# Altium project Router.PrjPcb
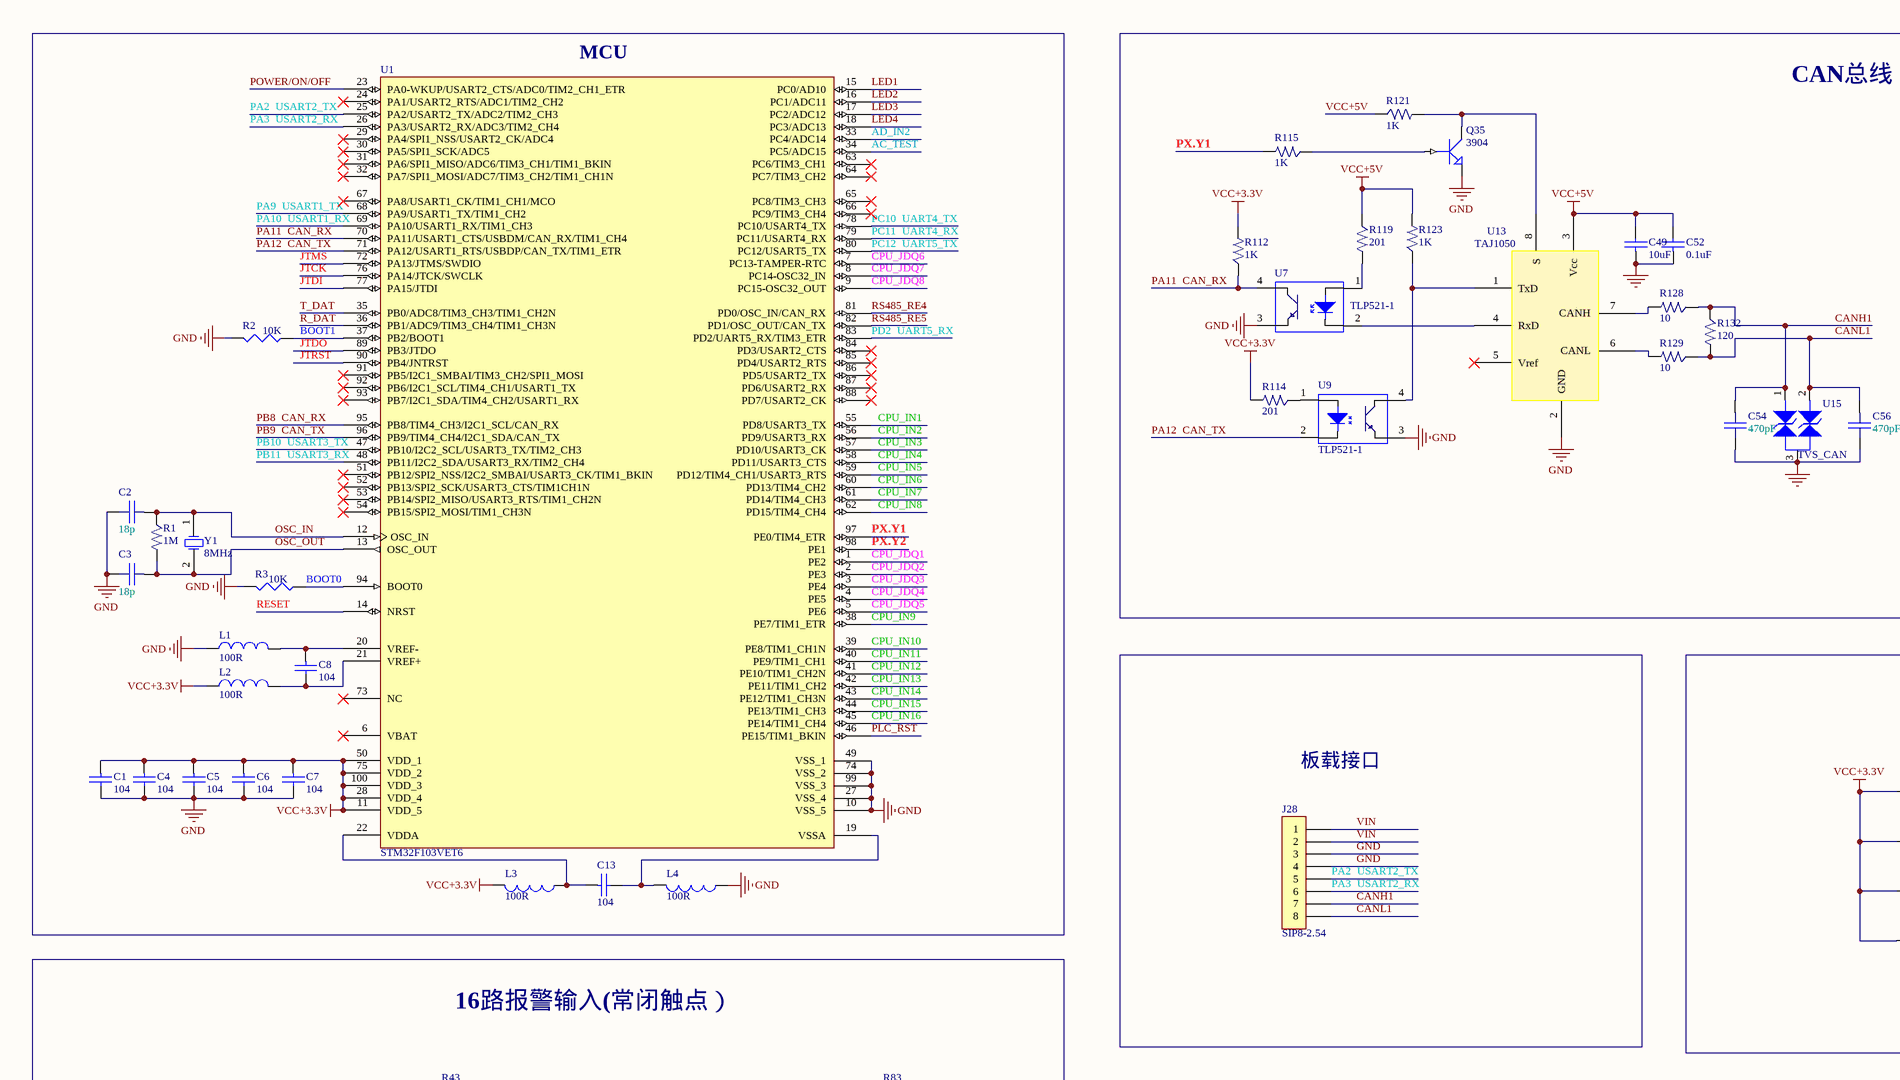
[diagram p0: Sheet1.SchDoc, top left]
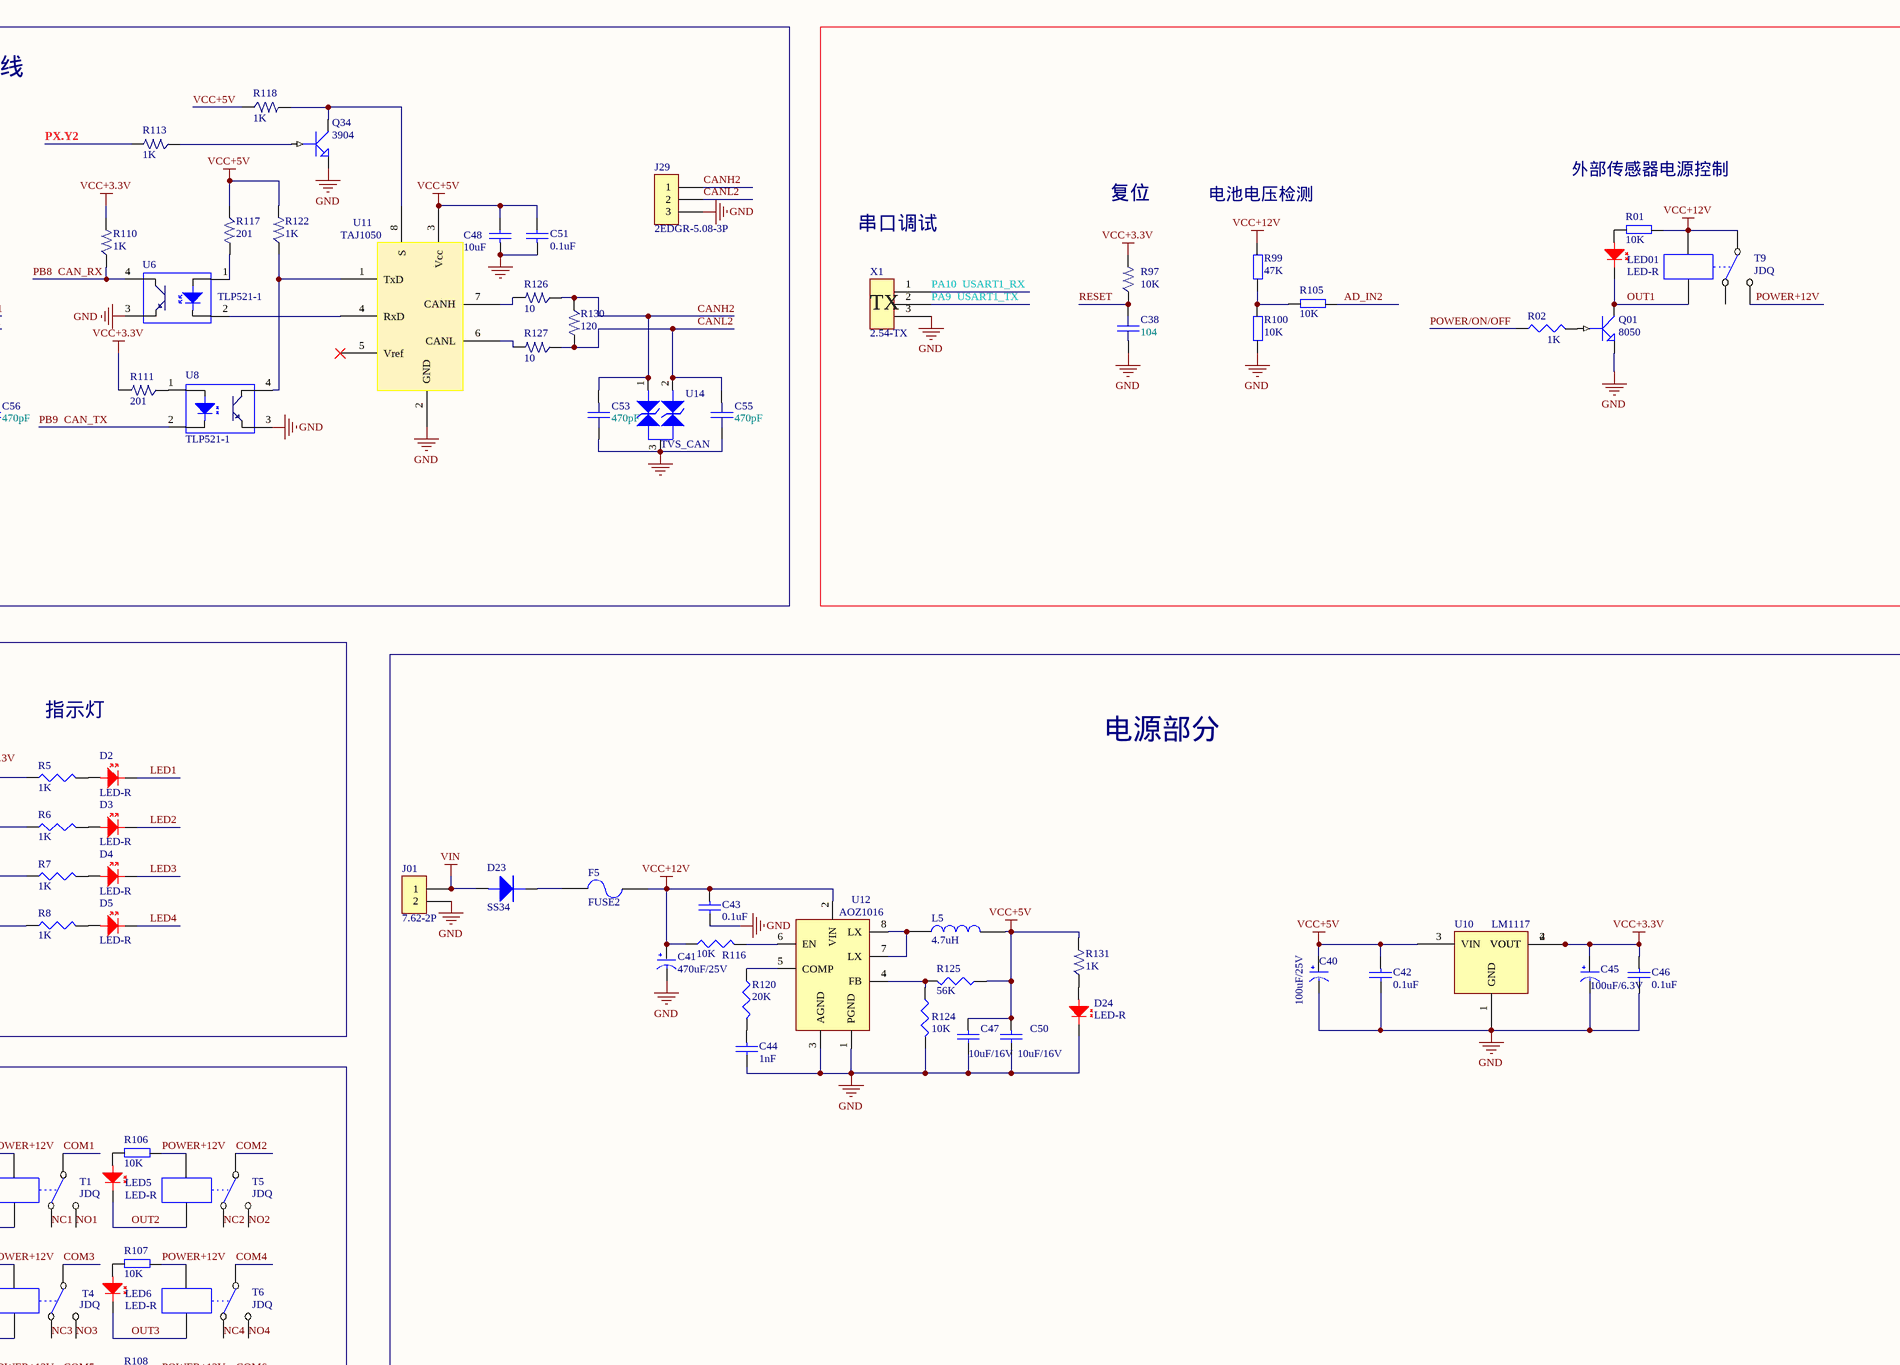
[diagram p1: Sheet1.SchDoc, top right]
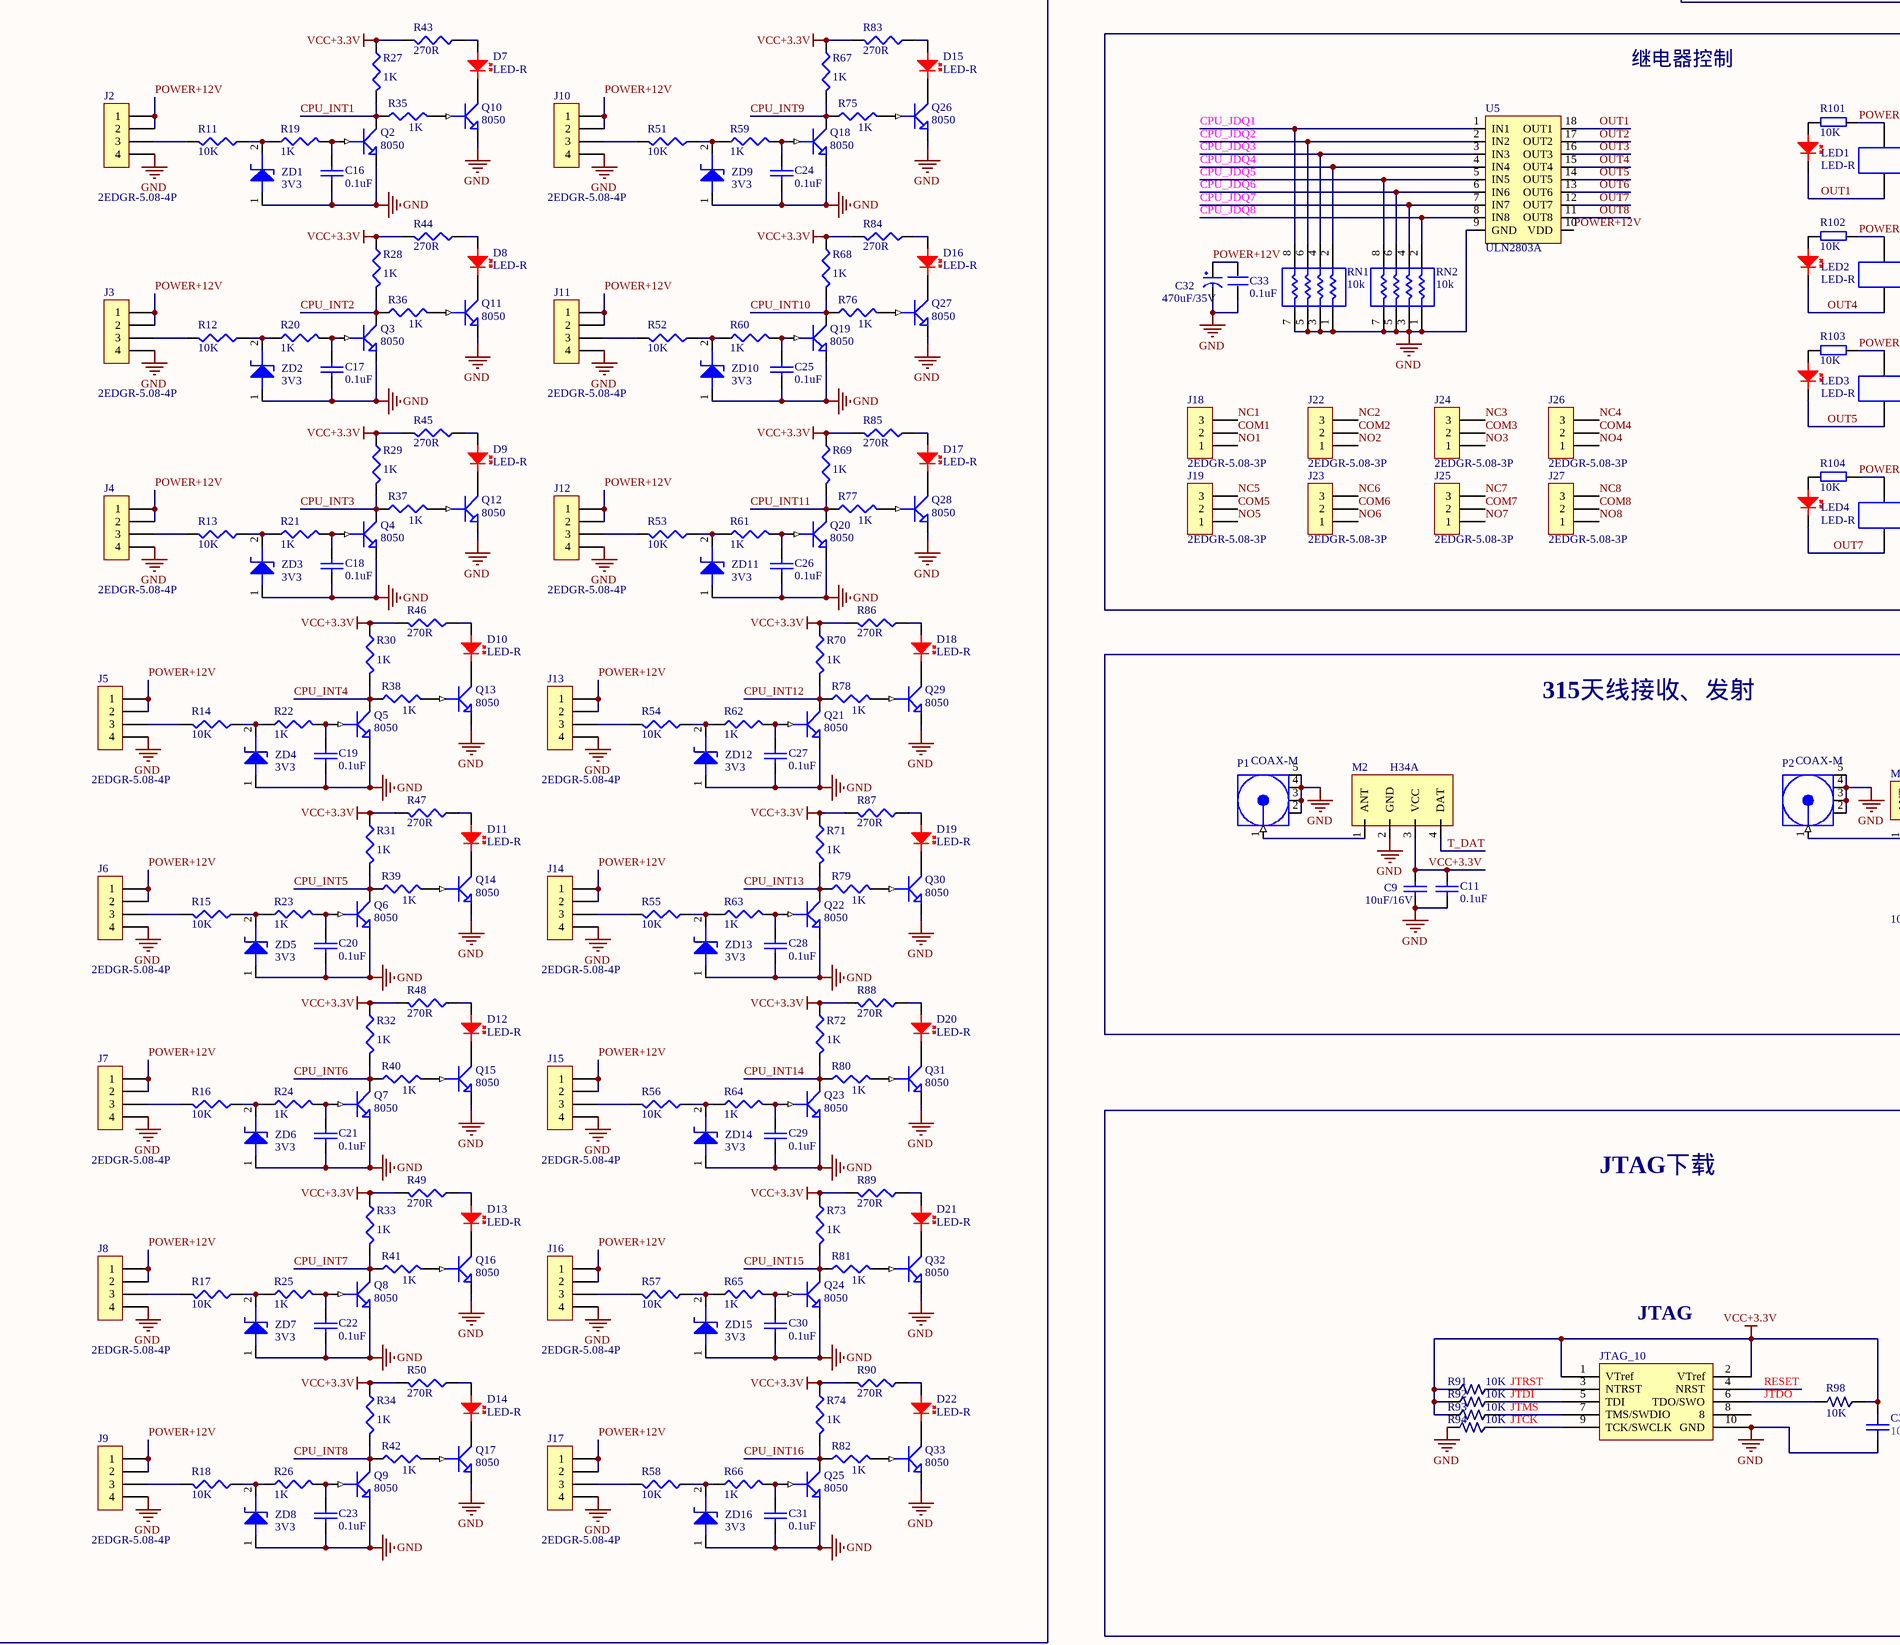
[diagram p2: Sheet1.SchDoc, bottom left]
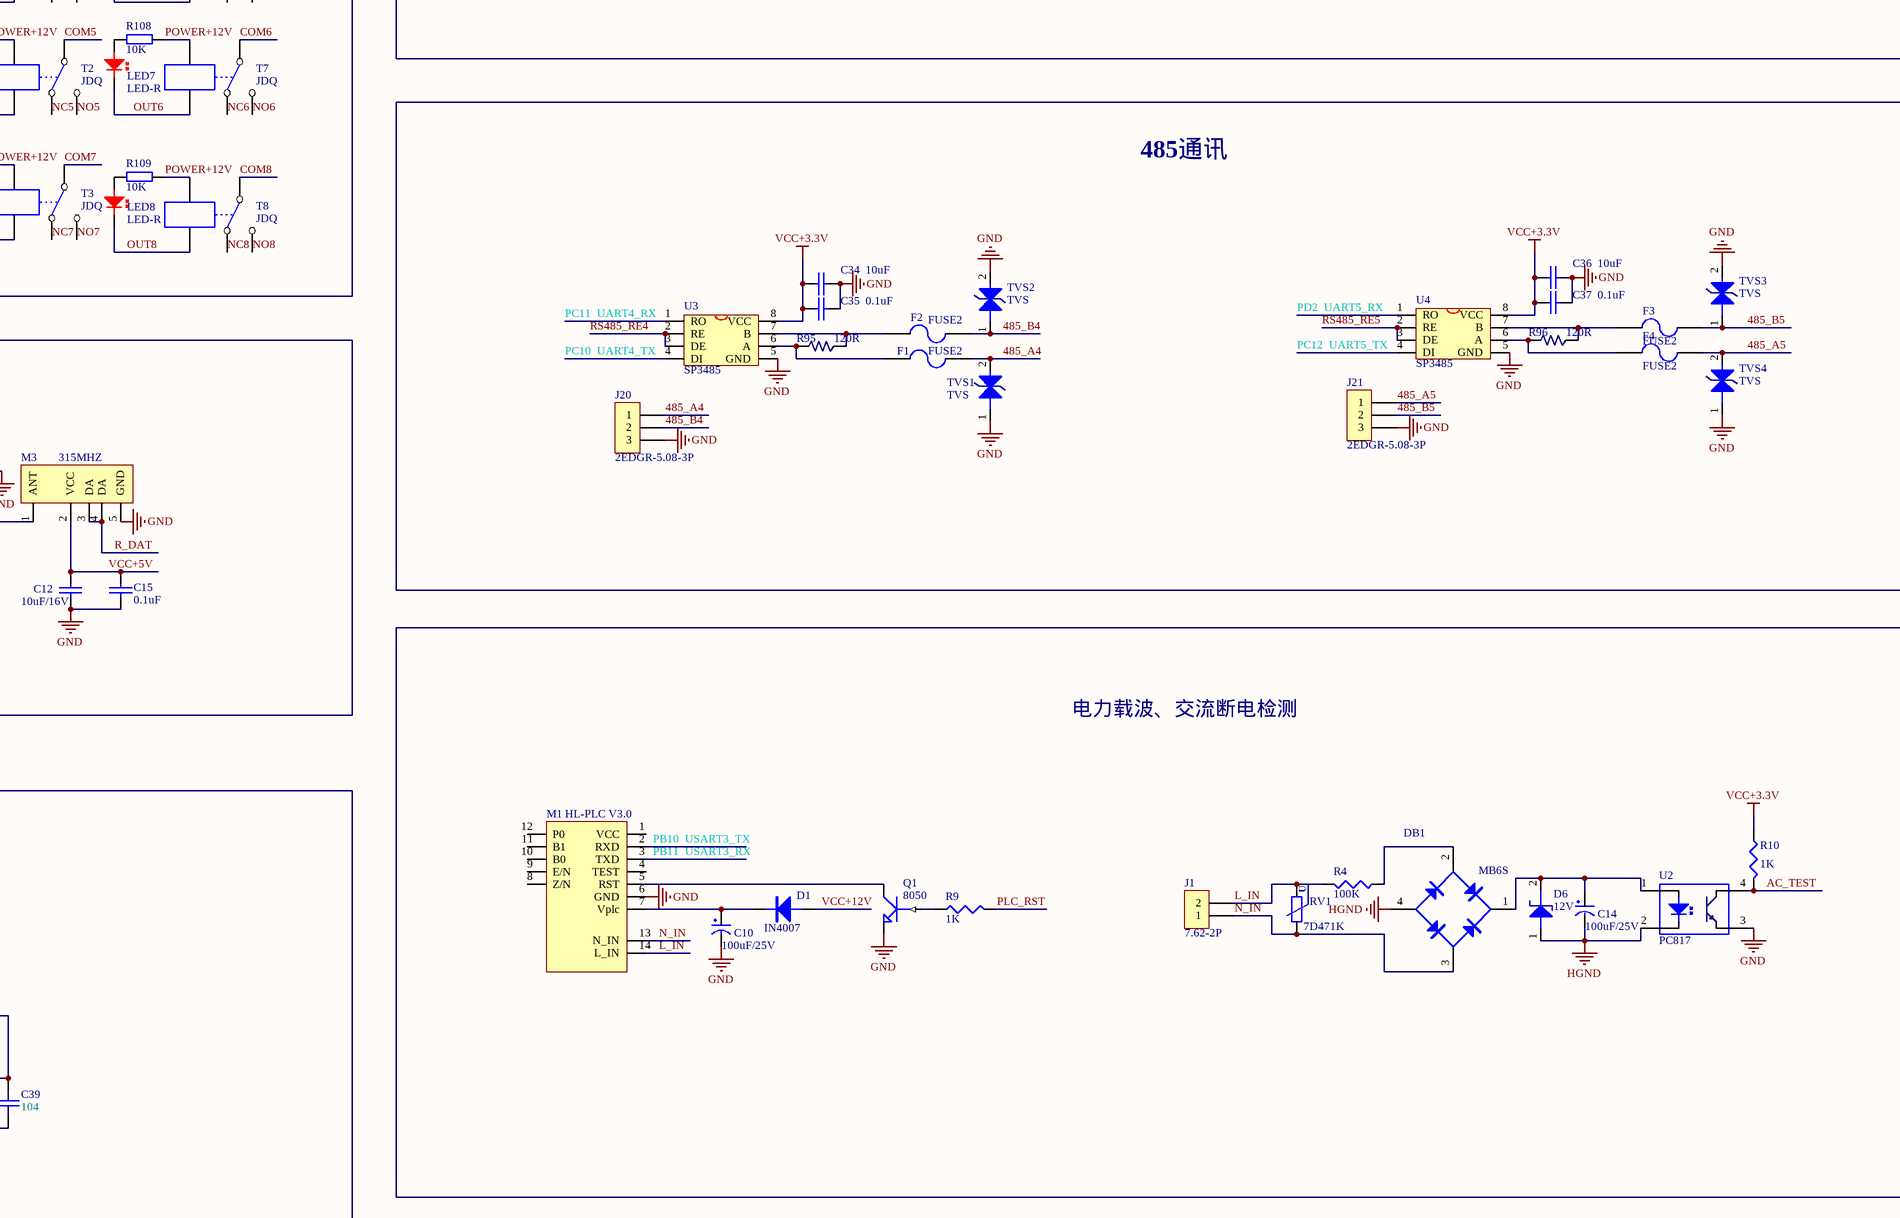
[diagram p3: Sheet1.SchDoc, bottom right]
1 sheet, 355 parts. Net scope: global (net labels, ports and power ports of the same name join across sheets).
Board file: PCB1.PcbDoc

## Sheet Sheet1.SchDoc
size A1

### Parts
C1  104  [0603]
C2  18p  [0603]
C3  18p  [0603]
C4  104  [0603]
C5  104  [0603]
C6  104  [0603]
C7  104  [0603]
C8  104  [0603]
C9  10uF/16V  [0805]
C10  100uF/25V  [RB2.54]
C11  0.1uF  [0603]
C12  10uF/16V  [0805]
C13  104  [0603]
C14  100uF/25V  [RB2.54]
C15  0.1uF  [0603]
C16  0.1uF  [0603]
C17  0.1uF  [0603]
C18  0.1uF  [0603]
C19  0.1uF  [0603]
C20  0.1uF  [0603]
C21  0.1uF  [0603]
C22  0.1uF  [0603]
C23  0.1uF  [0603]
C24  0.1uF  [0603]
C25  0.1uF  [0603]
C26  0.1uF  [0603]
C27  0.1uF  [0603]
C28  0.1uF  [0603]
C29  0.1uF  [0603]
C30  0.1uF  [0603]
C31  0.1uF  [0603]
C32  470uF/35V  [RB5.0-10]
C33  0.1uF  [0603]
C34  10uF  [0805]
C35  0.1uF  [0603]
C36  10uF  [0805]
C37  0.1uF  [0603]
C38  104  [0805]
C39  104  [0805]
C40  100uF/25V  [RB2.54]
C41  470uF/25V  [RB3.5]
C42  0.1uF  [0603]
C43  0.1uF  [0603]
C44  1nF  [0603]
C45  100uF/6.3V  [RB2.54]
C46  0.1uF  [0603]
C47  10uF/16V  [0805]
C48  10uF  [0805]
C49  10uF  [0805]
C50  10uF/16V  [0805]
C51  0.1uF  [0603]
C52  0.1uF  [0603]
C53  470pF  [0603]
C54  470pF  [0603]
C55  470pF  [0603]
C56  470pF  [0603]
D1  IN4007  [SMB]
D2  LED-R  [LED-0805]
D3  LED-R  [LED-0805]
D4  LED-R  [LED-0805]
D5  LED-R  [LED-0805]
D6  12V  [SOD-123A]
D7  LED-R  [LED-0805]
D8  LED-R  [LED-0805]
D9  LED-R  [LED-0805]
D10  LED-R  [LED-0805]
D11  LED-R  [LED-0805]
D12  LED-R  [LED-0805]
D13  LED-R  [LED-0805]
D14  LED-R  [LED-0805]
D15  LED-R  [LED-0805]
D16  LED-R  [LED-0805]
D17  LED-R  [LED-0805]
D18  LED-R  [LED-0805]
D19  LED-R  [LED-0805]
D20  LED-R  [LED-0805]
D21  LED-R  [LED-0805]
D22  LED-R  [LED-0805]
D23  SS34  [SMB]
D24  LED-R  [LED-0805]
DB1  MB6S  [SOIC-4]
F1  FUSE2  [0805]
F2  FUSE2  [0805]
F3  FUSE2  [0805]
F4  FUSE2  [0805]
F5  FUSE2  [FUSE RL60-110]
J1  7.62-2P  [7.62-2]
J01  7.62-2P  [5.08-2P]
J2  2EDGR-5.08-4P  [3.81-4P]
J3  2EDGR-5.08-4P  [3.81-4P]
J4  2EDGR-5.08-4P  [3.81-4P]
J5  2EDGR-5.08-4P  [3.81-4P]
J6  2EDGR-5.08-4P  [3.81-4P]
J7  2EDGR-5.08-4P  [3.81-4P]
J8  2EDGR-5.08-4P  [3.81-4P]
J9  2EDGR-5.08-4P  [3.81-4P]
J10  2EDGR-5.08-4P  [3.81-4P]
J11  2EDGR-5.08-4P  [3.81-4P]
J12  2EDGR-5.08-4P  [3.81-4P]
J13  2EDGR-5.08-4P  [3.81-4P]
J14  2EDGR-5.08-4P  [3.81-4P]
J15  2EDGR-5.08-4P  [3.81-4P]
J16  2EDGR-5.08-4P  [3.81-4P]
J17  2EDGR-5.08-4P  [3.81-4P]
J18  2EDGR-5.08-3P  [5.08-3P]
J19  2EDGR-5.08-3P  [5.08-3P]
J20  2EDGR-5.08-3P  [5.08-3P]
J21  2EDGR-5.08-3P  [5.08-3P]
J22  2EDGR-5.08-3P  [5.08-3P]
J23  2EDGR-5.08-3P  [5.08-3P]
J24  2EDGR-5.08-3P  [5.08-3P]
J25  2EDGR-5.08-3P  [5.08-3P]
J26  2EDGR-5.08-3P  [5.08-3P]
J27  2EDGR-5.08-3P  [5.08-3P]
J28  SIP8-2.54  [2.54-8]
J29  2EDGR-5.08-3P  [5.08-3P]
JTAG_1  JTAG_10  [JTAG_10]
L1  100R  [0805]
L2  100R  [0805]
L3  100R  [0805]
L4  100R  [0805]
L5  4.7uH  [INDUCTOR 7*7]
LED1  LED-R  [LED-0805]
LED01  LED-R  [LED-0805]
LED2  LED-R  [LED-0805]
LED3  LED-R  [LED-0805]
LED4  LED-R  [LED-0805]
LED5  LED-R  [LED-0805]
LED6  LED-R  [LED-0805]
LED7  LED-R  [LED-0805]
LED8  LED-R  [LED-0805]
M1  HL-PLC V3.0  [HL-PLC V3.0]
M2  H34A  [H34A]
M3  315MHZ  [315MHZ]
P1  COAX-M  [ST-TH1]
P2  COAX-M  [ST-TH1]
Q1  8050  [SOT-23]
Q01  8050  [SOT-23]
Q2  8050  [SOT-23]
Q3  8050  [SOT-23]
Q4  8050  [SOT-23]
Q5  8050  [SOT-23]
Q6  8050  [SOT-23]
Q7  8050  [SOT-23]
Q8  8050  [SOT-23]
Q9  8050  [SOT-23]
Q10  8050  [SOT-23]
Q11  8050  [SOT-23]
Q12  8050  [SOT-23]
Q13  8050  [SOT-23]
Q14  8050  [SOT-23]
Q15  8050  [SOT-23]
Q16  8050  [SOT-23]
Q17  8050  [SOT-23]
Q18  8050  [SOT-23]
Q19  8050  [SOT-23]
Q20  8050  [SOT-23]
Q21  8050  [SOT-23]
Q22  8050  [SOT-23]
Q23  8050  [SOT-23]
Q24  8050  [SOT-23]
Q25  8050  [SOT-23]
Q26  8050  [SOT-23]
Q27  8050  [SOT-23]
Q28  8050  [SOT-23]
Q29  8050  [SOT-23]
Q30  8050  [SOT-23]
Q31  8050  [SOT-23]
Q32  8050  [SOT-23]
Q33  8050  [SOT-23]
Q34  3904  [SOT-23]
Q35  3904  [SOT-23]
R1  1M  [0805]
R01  10K  [0603]
R2  10K  [0603]
R02  1K  [0603]
R3  10K  [0603]
R4  100K  [AXIAL0.6]
R5  1K  [0603]
R6  1K  [0603]
R7  1K  [0603]
R8  1K  [0603]
R9  1K  [0603]
R10  1K  [0603]
R11  10K  [0603]
R12  10K  [0603]
R13  10K  [0603]
R14  10K  [0603]
R15  10K  [0603]
R16  10K  [0603]
R17  10K  [0603]
R18  10K  [0603]
R19  1K  [0603]
R20  1K  [0603]
R21  1K  [0603]
R22  1K  [0603]
R23  1K  [0603]
R24  1K  [0603]
R25  1K  [0603]
R26  1K  [0603]
R27  1K  [0603]
R28  1K  [0603]
R29  1K  [0603]
R30  1K  [0603]
R31  1K  [0603]
R32  1K  [0603]
R33  1K  [0603]
R34  1K  [0603]
R35  1K  [0603]
R36  1K  [0603]
R37  1K  [0603]
R38  1K  [0603]
R39  1K  [0603]
R40  1K  [0603]
R41  1K  [0603]
R42  1K  [0603]
R43  270R  [0603]
R44  270R  [0603]
R45  270R  [0603]
R46  270R  [0603]
R47  270R  [0603]
R48  270R  [0603]
R49  270R  [0603]
R50  270R  [0603]
R51  10K  [0603]
R52  10K  [0603]
R53  10K  [0603]
R54  10K  [0603]
R55  10K  [0603]
R56  10K  [0603]
R57  10K  [0603]
R58  10K  [0603]
R59  1K  [0603]
R60  1K  [0603]
R61  1K  [0603]
R62  1K  [0603]
R63  1K  [0603]
R64  1K  [0603]
R65  1K  [0603]
R66  1K  [0603]
R67  1K  [0603]
R68  1K  [0603]
R69  1K  [0603]
R70  1K  [0603]
R71  1K  [0603]
R72  1K  [0603]
R73  1K  [0603]
R74  1K  [0603]
R75  1K  [0603]
R76  1K  [0603]
R77  1K  [0603]
R78  1K  [0603]
R79  1K  [0603]
R80  1K  [0603]
R81  1K  [0603]
R82  1K  [0603]
R83  270R  [0603]
R84  270R  [0603]
R85  270R  [0603]
R86  270R  [0603]
R87  270R  [0603]
R88  270R  [0603]
R89  270R  [0603]
R90  270R  [0603]
R91  10K  [0805]
R92  10K  [0805]
R93  10K  [0805]
R94  10K  [0805]
R95  120R  [0603]
R96  120R  [0603]
R97  10K  [0805]
R98  10K  [0805]
R99  47K  [0805]
R100  10K  [0805]
R101  10K  [0603]
R102  10K  [0603]
R103  10K  [0603]
R104  10K  [0603]
R105  10K  [0805]
R106  10K  [0603]
R107  10K  [0603]
R108  10K  [0603]
R109  10K  [0603]
R110  1K  [0603]
R111  201  [0603]
R112  1K  [0603]
R113  1K  [0603]
R114  201  [0603]
R115  1K  [0603]
R116  10K  [0603]
R117  201  [0603]
R118  1K  [0603]
R119  201  [0603]
R120  20K  [0603]
R121  1K  [0603]
R122  1K  [0603]
R123  1K  [0603]
R124  10K  [0603]
R125  56K  [0603]
R126  10  [0603]
R127  10  [0603]
R128  10  [0603]
R129  10  [0603]
R130  120  [0603]
R131  1K  [0603]
R132  120  [0603]
RN1  10k  [0603-4]
RN2  10k  [0603-4]
RV1  7D471K  [7D471]
T1  JDQ  [JDQ]
T2  JDQ  [JDQ]
T3  JDQ  [JDQ]
T4  JDQ  [JDQ]
T5  JDQ  [JDQ]
T6  JDQ  [JDQ]
T7  JDQ  [JDQ]
T8  JDQ  [JDQ]
T9  JDQ  [JDQ]
TVS1  TVS  [SMB]
TVS2  TVS  [SMB]
TVS3  TVS  [SMB]
TVS4  TVS  [SMB]
U1  STM32F103VET6  [LQFP100_L]
U2  PC817  [DIP4]
U3  SP3485  [SOP-8]
U4  SP3485  [SOP-8]
U5  ULN2803A  [SOIC-18]
U6  TLP521-1  [DIP4]
U7  TLP521-1  [DIP4]
U8  TLP521-1  [DIP4]
U9  TLP521-1  [DIP4]
U10  LM1117  [SOT-223]
U11  TAJ1050  [SO-8]
U12  AOZ1016  [SO-8]
U13  TAJ1050  [SO-8]
U14  TVS_CAN  [SOT-23]
U15  TVS_CAN  [SOT-23]
X1  2.54-TX  [2.54-TX]
Y1  8MHz  [XTAL_US]
ZD1  3V3  [SOD-123]
ZD2  3V3  [SOD-123]
ZD3  3V3  [SOD-123]
ZD4  3V3  [SOD-123]
ZD5  3V3  [SOD-123]
ZD6  3V3  [SOD-123]
ZD7  3V3  [SOD-123]
ZD8  3V3  [SOD-123]
ZD9  3V3  [SOD-123]
ZD10  3V3  [SOD-123]
ZD11  3V3  [SOD-123]
ZD12  3V3  [SOD-123]
ZD13  3V3  [SOD-123]
ZD14  3V3  [SOD-123]
ZD15  3V3  [SOD-123]
ZD16  3V3  [SOD-123]

### Blocks framed on the sheet
MCU: C1-C8 C13 L1-L4 R1-R3 U1 Y1
CAN总线: C48 C49 C51-C56 J29 Q34 Q35 R110-R115 R117-R119 R121-R123 R126-R130 R132 U6-U9 U11 U13-U15
板载接口: J28
指示灯: D2-D5 R5-R8
电源部分: C40-C47 C50 D23 D24 F5 J01 L5 R116 R120 R124 R125 R131 U10 U12
16路报警输入(常闭触点）: C16-C31 D7-D22 J2-J17 Q2-Q33 R11-R90 ZD1-ZD16
继电器控制: C32 C33 J18 J19 J22-J27 LED1-LED8 R101-R104 R106-R109 RN1 RN2 T1-T8 U5
485通讯: C34-C37 F1-F4 J20 J21 R95 R96 TVS1-TVS4 U3 U4
315天线接收、发射: C9 C11 C12 C15 M2 M3 P1 P2
电力载波、交流断电检测: C10 C14 D1 D6 DB1 J1 M1 Q1 R4 R9 R10 RV1 U2
JTAG下载: C39 JTAG_1 R91-R94 R98

### Nets
GND: C1.2 C2.2 C3.2 C4.2 C5.2 C6.2 C7.2 C9.1 C10.2(GND) C11.2 C12.2 C15.2 C16.2 C17.2 C18.2 C19.2 C20.2 C21.2 C22.2 C23.2 C24.2 C25.2 C26.2 C27.2 C28.2 C29.2 C30.2 C31.2 C32.2(GND) C33.1 C34.2 C35.2 C36.2 C37.2 C38.1 C39.2 C40.2(GND) C41.2(GND) C42.2 C43.2 C44.2 C45.2(GND) C46.2 C47.2 C48.1 C49.1 C50.2 C51.1 C52.1 C53.2 C54.2 C55.2 C56.2 D24.2 J01.2 J2.4 J3.4 J4.4 J5.4 J6.4 J7.4 J8.4 J9.4 J10.4 J11.4 J12.4 J13.4 J14.4 J15.4 J16.4 J17.4 J20.3 J21.3 J28.3 J28.4 J29.3 JTAG_1.10(GND) L1.1 L4.1 M1.6(GND) M2.2(GND) M3.5(GND) P1.2(GND) P1.3(GND) P1.4(GND) P1.5(GND) P2.2(GND) P2.3(GND) P2.4(GND) P2.5(GND) Q1.2(E) Q01.2(E) Q2.2(E) Q3.2(E) Q4.2(E) Q5.2(E) Q6.2(E) Q7.2(E) Q8.2(E) Q9.2(E) Q10.2(E) Q11.2(E) Q12.2(E) Q13.2(E) Q14.2(E) Q15.2(E) Q16.2(E) Q17.2(E) Q18.2(E) Q19.2(E) Q20.2(E) Q21.2(E) Q22.2(E) Q23.2(E) Q24.2(E) Q25.2(E) Q26.2(E) Q27.2(E) Q28.2(E) Q29.2(E) Q30.2(E) Q31.2(E) Q32.2(E) Q33.2(E) Q34.2(E) Q35.2(E) R2.2 R3.2 R94.2 R100.1 R124.2 RN1.1 RN1.3 RN1.5 RN1.7 RN2.1 RN2.3 RN2.5 RN2.7 TVS1.1(A) TVS2.2(K) TVS3.2(K) TVS4.1(A) U1.10(VSS_5) U1.27(VSS_4) U1.49(VSS_1) U1.74(VSS_2) U1.99(VSS_3) U2.3 U3.5(GND) U4.5(GND) U5.9(GND) U6.3 U7.3 U8.3 U9.3 U10.1(GND) U11.2(GND) U12.1(PGND) U12.3(AGND) U13.2(GND) U14.3 U15.3 X1.3 ZD1.1(A) ZD2.1(A) ZD3.1(A) ZD4.1(A) ZD5.1(A) ZD6.1(A) ZD7.1(A) ZD8.1(A) ZD9.1(A) ZD10.1(A) ZD11.1(A) ZD12.1(A) ZD13.1(A) ZD14.1(A) ZD15.1(A) ZD16.1(A)
HGND: C14.2(GND) D6.1(A) DB1.4(V-) U2.2
VCC+3.3V: C1.1 C4.1 C5.1 C6.1 C7.1 C9.2 C11.1 C34.1 C35.1 C36.1 C37.1 C39.1 C45.1(VCC) C46.1 JTAG_1.1(VTref) JTAG_1.2(VTref) L2.1 L3.2 M2.3(VCC) R5.1 R6.1 R7.1 R8.1 R10.1 R27.1 R28.1 R29.1 R30.1 R31.1 R32.1 R33.1 R34.1 R43.2 R44.2 R45.2 R46.2 R47.2 R48.2 R49.2 R50.2 R67.1 R68.1 R69.1 R70.1 R71.1 R72.1 R73.1 R74.1 R83.2 R84.2 R85.2 R86.2 R87.2 R88.2 R89.2 R90.2 R91.1 R92.1 R93.1 R97.2 R98.1 R110.2 R111.2 R112.2 R114.2 U1.11(VDD_5) U1.28(VDD_4) U1.50(VDD_1) U1.75(VDD_2) U1.100(VDD_3) U3.8(VCC) U4.8(VCC) U10.2(VOUT) U10.4(VOUT)
VCC+5V: C12.1 C15.1 C40.1(VCC) C42.1 C47.1 C48.2 C49.2 C50.1 C51.2 C52.2 L5.2 M3.2(VCC) R117.1 R118.1 R119.1 R121.1 R122.2 R123.2 R125.1 R131.2 U10.3(VIN) U11.3(Vcc) U13.3(Vcc)
VCC+12V: C41.1(VCC) C43.1 D1.1(A) F5.2 R01.1 R99.2 R116.1 T9.1 T9.4 U12.2(VIN)
VIN: D23.1(A) J01.1 J28.1 J28.2
485_A4: F1.2 J20.1 TVS1.2(K)
485_A5: F4.2 J21.1 TVS4.2(K)
485_B4: F2.2 J20.2 TVS2.1(A)
485_B5: F3.2 J21.2 TVS3.1(A)
AC_TEST: R10.2 U1.34(PC5/ADC15) U2.4
AD_IN2: R105.1 U1.33(PC4/ADC14)
BOOT0: R3.1 U1.94(BOOT0)
BOOT1: R2.1 U1.37(PB2/BOOT1)
CANH1: C54.1 J28.7 R128.1 R132.1 U15.1
CANH2: C53.1 J29.1 R126.1 R130.1 U14.1
CANL1: C56.1 J28.8 R129.1 R132.2 U15.2(K)
CANL2: C55.1 J29.2 R127.1 R130.2 U14.2(K)
COM1: J18.2 T1.1
COM2: J22.2 T5.1
COM3: J24.2 T4.1
COM4: J26.2 T6.1
COM5: J19.2 T2.1
COM6: J23.2 T7.1
COM7: J25.2 T3.1
COM8: J27.2 T8.1
CPU_IN1: U1.55(PD8/USART3_TX)
CPU_IN2: U1.56(PD9/USART3_RX)
CPU_IN3: U1.57(PD10/USART3_CK)
CPU_IN4: U1.58(PD11/USART3_CTS)
CPU_IN5: U1.59(PD12/TIM4_CH1/USART3_RTS)
CPU_IN6: U1.60(PD13/TIM4_CH2)
CPU_IN7: U1.61(PD14/TIM4_CH3)
CPU_IN8: U1.62(PD15/TIM4_CH4)
CPU_IN9: U1.38(PE7/TIM1_ETR)
CPU_IN10: U1.39(PE8/TIM1_CH1N)
CPU_IN11: U1.40(PE9/TIM1_CH1)
CPU_IN12: U1.41(PE10/TIM1_CH2N)
CPU_IN13: U1.42(PE11/TIM1_CH2)
CPU_IN14: U1.43(PE12/TIM1_CH3N)
CPU_IN15: U1.44(PE13/TIM1_CH3)
CPU_IN16: U1.45(PE14/TIM1_CH4)
CPU_INT1: Q2.3(C) R27.2 R35.1
CPU_INT2: Q3.3(C) R28.2 R36.1
CPU_INT3: Q4.3(C) R29.2 R37.1
CPU_INT4: Q5.3(C) R30.2 R38.1
CPU_INT5: Q6.3(C) R31.2 R39.1
CPU_INT6: Q7.3(C) R32.2 R40.1
CPU_INT7: Q8.3(C) R33.2 R41.1
CPU_INT8: Q9.3(C) R34.2 R42.1
CPU_INT9: Q18.3(C) R67.2 R75.1
CPU_INT10: Q19.3(C) R68.2 R76.1
CPU_INT11: Q20.3(C) R69.2 R77.1
CPU_INT12: Q21.3(C) R70.2 R78.1
CPU_INT13: Q22.3(C) R71.2 R79.1
CPU_INT14: Q23.3(C) R72.2 R80.1
CPU_INT15: Q24.3(C) R73.2 R81.1
CPU_INT16: Q25.3(C) R74.2 R82.1
CPU_JDQ1: RN1.8 U1.1(PE2) U5.1(IN1)
CPU_JDQ2: RN1.6 U1.2(PE3) U5.2(IN2)
CPU_JDQ3: RN1.4 U1.3(PE4) U5.3(IN3)
CPU_JDQ4: RN1.2 U1.4(PE5) U5.4(IN4)
CPU_JDQ5: RN2.8 U1.5(PE6) U5.5(IN5)
CPU_JDQ6: RN2.6 U1.7(PC13-TAMPER-RTC) U5.6(IN6)
CPU_JDQ7: RN2.4 U1.8(PC14-OSC32_IN) U5.7(IN7)
CPU_JDQ8: RN2.2 U1.9(PC15-OSC32_OUT) U5.8(IN8)
JTCK: JTAG_1.9(TCK/SWCLK) R94.1 U1.76(PA14/JTCK/SWCLK)
JTDI: JTAG_1.5(TDI) R92.2 U1.77(PA15/JTDI)
JTDO: JTAG_1.6(TDO/SWO) R98.2 U1.89(PB3/JTDO)
JTMS: JTAG_1.7(TMS/SWDIO) R93.2 U1.72(PA13/JTMS/SWDIO)
JTRST: JTAG_1.3(NTRST) R91.2 U1.90(PB4/JNTRST)
L_IN: J1.2 M1.14(L_IN) R4.2 RV1.2
LED1: D2.2 U1.15(PC0/AD10)
LED2: D3.2 U1.16(PC1/ADC11)
LED3: D4.2 U1.17(PC2/ADC12)
LED4: D5.2 U1.18(PC3/ADC13)
N_IN: DB1.3(AC) J1.1 M1.13(N_IN) RV1.1
NC1: J18.3 T1.3
NC2: J22.3 T5.3
NC3: J24.3 T4.3
NC4: J26.3 T6.3
NC5: J19.3 T2.3
NC6: J23.3 T7.3
NC7: J25.3 T3.3
NC8: J27.3 T8.3
NO1: J18.1 T1.2
NO2: J22.1 T5.2
NO3: J24.1 T4.2
NO4: J26.1 T6.2
NO5: J19.1 T2.2
NO6: J23.1 T7.2
NO7: J25.1 T3.2
NO8: J27.1 T8.2
OSC_IN: C2.1 R1.1 U1.12(OSC_IN) Y1.1(OSC1)
OSC_OUT: C3.1 R1.2 U1.13(OSC_OUT) Y1.2(OSC2)
OUT1: LED1.2 LED01.2 Q01.3(C) T1.5 T9.5 U5.18(OUT1)
OUT2: LED5.2 T5.5 U5.17(OUT2)
OUT3: LED6.2 T6.5 U5.16(OUT3)
OUT4: LED2.2 T4.5 U5.15(OUT4)
OUT5: LED3.2 T2.5 U5.14(OUT5)
OUT6: LED7.2 T7.5 U5.13(OUT6)
OUT7: LED4.2 T3.5 U5.12(OUT7)
OUT8: LED8.2 T8.5 U5.11(OUT8)
PA2  USART2_TX: J28.5 U1.25(PA2/USART2_TX/ADC2/TIM2_CH3)
PA3  USART2_RX: J28.6 U1.26(PA3/USART2_RX/ADC3/TIM2_CH4)
PA9  USART1_TX: U1.68(PA9/USART1_TX/TIM1_CH2) X1.2
PA10  USART1_RX: U1.69(PA10/USART1_RX/TIM1_CH3) X1.1
PA11  CAN_RX: R112.1 U1.70(PA11/USART1_CTS/USBDM/CAN_RX/TIM1_CH4) U7.4
PA12  CAN_TX: U1.71(PA12/USART1_RTS/USBDP/CAN_TX/TIM1_ETR) U9.2
PB8  CAN_RX: R110.1 U1.95(PB8/TIM4_CH3/I2C1_SCL/CAN_RX) U6.4
PB9  CAN_TX: U1.96(PB9/TIM4_CH4/I2C1_SDA/CAN_TX) U8.2
PB10  USART3_TX: M1.2(RXD) U1.47(PB10/I2C2_SCL/USART3_TX/TIM2_CH3)
PB11  USART3_RX: M1.3(TXD) U1.48(PB11/I2C2_SDA/USART3_RX/TIM2_CH4)
PC10  UART4_TX: U1.78(PC10/USART4_TX) U3.4(DI)
PC11  UART4_RX: U1.79(PC11/USART4_RX) U3.1(RO)
PC12  UART5_TX: U1.80(PC12/USART5_TX) U4.4(DI)
PD2  UART5_RX: U1.83(PD2/UART5_RX/TIM3_ETR) U4.1(RO)
PLC_RST: R9.2 U1.46(PE15/TIM1_BKIN)
POWER+12V: C32.1(VCC) C33.2 J2.1 J2.2 J3.1 J3.2 J4.1 J4.2 J5.1 J5.2 J6.1 J6.2 J7.1 J7.2 J8.1 J8.2 J9.1 J9.2 J10.1 J10.2 J11.1 J11.2 J12.1 J12.2 J13.1 J13.2 J14.1 J14.2 J15.1 J15.2 J16.1 J16.2 J17.1 J17.2 R101.1 R102.1 R103.1 R104.1 R106.1 R107.1 R108.1 R109.1 T1.4 T2.4 T3.4 T4.4 T5.4 T6.4 T7.4 T8.4 T9.2 U5.10(VDD)
POWER/ON/OFF: R02.1 U1.23(PA0-WKUP/USART2_CTS/ADC0/TIM2_CH1_ETR)
PX.Y1: R115.2 U1.97(PE0/TIM4_ETR)
PX.Y2: R113.2 U1.98(PE1)
R_DAT: M3.3(DA) M3.4(DA) U1.36(PB1/ADC9/TIM3_CH4/TIM1_CH3N)
RESET: C38.2 JTAG_1.4(NRST) R97.1 U1.14(NRST)
RS485_RE4: U1.81(PD0/OSC_IN/CAN_RX) U3.2(RE) U3.3(DE)
RS485_RE5: U1.82(PD1/OSC_OUT/CAN_TX) U4.2(RE) U4.3(DE)
T_DAT: M2.4(DAT) U1.35(PB0/ADC8/TIM3_CH3/TIM1_CH2N)
NetC8_1: C8.1 L1.2 U1.20(VREF-)
NetC8_2: C8.2 L2.2 U1.21(VREF+)
NetC10_1: C10.1(VCC) D1.2(K) M1.7(Vplc)
NetC13_1: C13.1 L3.1 U1.22(VDDA)
NetC13_2: C13.2 L4.2 U1.19(VSSA)
NetC14_1: C14.1(VCC) D6.2(K) DB1.1(V+) U2.1
NetC16_1: C16.1 Q2.1(B) R19.2
NetC17_1: C17.1 Q3.1(B) R20.2
NetC18_1: C18.1 Q4.1(B) R21.2
NetC19_1: C19.1 Q5.1(B) R22.2
NetC20_1: C20.1 Q6.1(B) R23.2
NetC21_1: C21.1 Q7.1(B) R24.2
NetC22_1: C22.1 Q8.1(B) R25.2
NetC23_1: C23.1 Q9.1(B) R26.2
NetC24_1: C24.1 Q18.1(B) R59.2
NetC25_1: C25.1 Q19.1(B) R60.2
NetC26_1: C26.1 Q20.1(B) R61.2
NetC27_1: C27.1 Q21.1(B) R62.2
NetC28_1: C28.1 Q22.1(B) R63.2
NetC29_1: C29.1 Q23.1(B) R64.2
NetC30_1: C30.1 Q24.1(B) R65.2
NetC31_1: C31.1 Q25.1(B) R66.2
NetC44_1: C44.1 R120.2
NetD2_1: D2.1 R5.2
NetD3_1: D3.1 R6.2
NetD4_1: D4.1 R7.2
NetD5_1: D5.1 R8.2
NetD7_1: D7.1 R43.1
NetD7_2: D7.2 Q10.3(C)
NetD8_1: D8.1 R44.1
NetD8_2: D8.2 Q11.3(C)
NetD9_1: D9.1 R45.1
NetD9_2: D9.2 Q12.3(C)
NetD10_1: D10.1 R46.1
NetD10_2: D10.2 Q13.3(C)
NetD11_1: D11.1 R47.1
NetD11_2: D11.2 Q14.3(C)
NetD12_1: D12.1 R48.1
NetD12_2: D12.2 Q15.3(C)
NetD13_1: D13.1 R49.1
NetD13_2: D13.2 Q16.3(C)
NetD14_1: D14.1 R50.1
NetD14_2: D14.2 Q17.3(C)
NetD15_1: D15.1 R83.1
NetD15_2: D15.2 Q26.3(C)
NetD16_1: D16.1 R84.1
NetD16_2: D16.2 Q27.3(C)
NetD17_1: D17.1 R85.1
NetD17_2: D17.2 Q28.3(C)
NetD18_1: D18.1 R86.1
NetD18_2: D18.2 Q29.3(C)
NetD19_1: D19.1 R87.1
NetD19_2: D19.2 Q30.3(C)
NetD20_1: D20.1 R88.1
NetD20_2: D20.2 Q31.3(C)
NetD21_1: D21.1 R89.1
NetD21_2: D21.2 Q32.3(C)
NetD22_1: D22.1 R90.1
NetD22_2: D22.2 Q33.3(C)
NetD23_2: D23.2(K) F5.1
NetD24_1: D24.1 R131.1
NetDB1_2: DB1.2(AC) R4.1
NetF1_1: F1.1 R95.2 U3.6(A)
NetF2_1: F2.1 R95.1 U3.7(B)
NetF3_1: F3.1 R96.1 U4.7(B)
NetF4_1: F4.1 R96.2 U4.6(A)
NetJ2_3: J2.3 R11.2
NetJ3_3: J3.3 R12.2
NetJ4_3: J4.3 R13.2
NetJ5_3: J5.3 R14.2
NetJ6_3: J6.3 R15.2
NetJ7_3: J7.3 R16.2
NetJ8_3: J8.3 R17.2
NetJ9_3: J9.3 R18.2
NetJ10_3: J10.3 R51.2
NetJ11_3: J11.3 R52.2
NetJ12_3: J12.3 R53.2
NetJ13_3: J13.3 R54.2
NetJ14_3: J14.3 R55.2
NetJ15_3: J15.3 R56.2
NetJ16_3: J16.3 R57.2
NetJ17_3: J17.3 R58.2
NetL5_1: L5.1 U12.7(LX) U12.8(LX)
NetLED1_1: LED1.1 R101.2
NetLED01_1: LED01.1 R01.2
NetLED2_1: LED2.1 R102.2
NetLED3_1: LED3.1 R103.2
NetLED4_1: LED4.1 R104.2
NetLED5_1: LED5.1 R106.2
NetLED6_1: LED6.1 R107.2
NetLED7_1: LED7.1 R108.2
NetLED8_1: LED8.1 R109.2
NetM1_5: M1.5(RST) Q1.3(C)
NetM2_1: M2.1(ANT) P1.1(Signal)
NetM3_1: M3.1(ANT) P2.1(Signal)
NetQ1_1: Q1.1(B) R9.1
NetQ01_1: Q01.1(B) R02.2
NetQ10_1: Q10.1(B) R35.2
NetQ11_1: Q11.1(B) R36.2
NetQ12_1: Q12.1(B) R37.2
NetQ13_1: Q13.1(B) R38.2
NetQ14_1: Q14.1(B) R39.2
NetQ15_1: Q15.1(B) R40.2
NetQ16_1: Q16.1(B) R41.2
NetQ17_1: Q17.1(B) R42.2
NetQ26_1: Q26.1(B) R75.2
NetQ27_1: Q27.1(B) R76.2
NetQ28_1: Q28.1(B) R77.2
NetQ29_1: Q29.1(B) R78.2
NetQ30_1: Q30.1(B) R79.2
NetQ31_1: Q31.1(B) R80.2
NetQ32_1: Q32.1(B) R81.2
NetQ33_1: Q33.1(B) R82.2
NetQ34_1: Q34.1(B) R113.1
NetQ34_3: Q34.3(C) R118.2 U11.8(S)
NetQ35_1: Q35.1(B) R115.1
NetQ35_3: Q35.3(C) R121.2 U13.8(S)
NetR11_1: R11.1 R19.1 ZD1.2(K)
NetR12_1: R12.1 R20.1 ZD2.2(K)
NetR13_1: R13.1 R21.1 ZD3.2(K)
NetR14_1: R14.1 R22.1 ZD4.2(K)
NetR15_1: R15.1 R23.1 ZD5.2(K)
NetR16_1: R16.1 R24.1 ZD6.2(K)
NetR17_1: R17.1 R25.1 ZD7.2(K)
NetR18_1: R18.1 R26.1 ZD8.2(K)
NetR51_1: R51.1 R59.1 ZD9.2(K)
NetR52_1: R52.1 R60.1 ZD10.2(K)
NetR53_1: R53.1 R61.1 ZD11.2(K)
NetR54_1: R54.1 R62.1 ZD12.2(K)
NetR55_1: R55.1 R63.1 ZD13.2(K)
NetR56_1: R56.1 R64.1 ZD14.2(K)
NetR57_1: R57.1 R65.1 ZD15.2(K)
NetR58_1: R58.1 R66.1 ZD16.2(K)
NetR99_1: R99.1 R100.2 R105.2
NetR111_1: R111.1 U8.1
NetR114_1: R114.1 U9.1
NetR116_2: R116.2 U12.6(EN)
NetR117_2: R117.2 U6.1
NetR119_2: R119.2 U7.1
NetR120_1: R120.1 U12.5(COMP)
NetR122_1: R122.1 U8.4 U11.1(TxD)
NetR123_1: R123.1 U9.4 U13.1(TxD)
NetR124_1: R124.1 R125.2 U12.4(FB)
NetR126_2: R126.2 U11.7(CANH)
NetR127_2: R127.2 U11.6(CANL)
NetR128_2: R128.2 U13.7(CANH)
NetR129_2: R129.2 U13.6(CANL)
NetU6_2: U6.2 U11.4(RxD)
NetU7_2: U7.2 U13.4(RxD)

Not connected (* = marked no-connect by the designer): JTAG_1 8; M1 1(VCC) 4(TEST) 8(Z/N) 9(E/N) 10(B0) 11(B1) 12(P0); T9 3; U1 6(VBAT)* 24(PA1/USART2_RTS/ADC1/TIM2_CH2)* 29(PA4/SPI1_NSS/USART2_CK/ADC4)* 30(PA5/SPI1_SCK/ADC5)* 31(PA6/SPI1_MISO/ADC6/TIM3_CH1/TIM1_BKIN)* 32(PA7/SPI1_MOSI/ADC7/TIM3_CH2/TIM1_CH1N)* 51(PB12/SPI2_NSS/I2C2_SMBAI/USART3_CK/TIM1_BKIN)* 52(PB13/SPI2_SCK/USART3_CTS/TIM1CH1N)* 53(PB14/SPI2_MISO/USART3_RTS/TIM1_CH2N)* 54(PB15/SPI2_MOSI/TIM1_CH3N)* 63(PC6/TIM3_CH1)* 64(PC7/TIM3_CH2)* 65(PC8/TIM3_CH3)* 66(PC9/TIM3_CH4)* 67(PA8/USART1_CK/TIM1_CH1/MCO)* 73(NC)* 84(PD3/USART2_CTS)* 85(PD4/USART2_RTS)* 86(PD5/USART2_TX)* 87(PD6/USART2_RX)* 88(PD7/USART2_CK)* 91(PB5/I2C1_SMBAI/TIM3_CH2/SPI1_MOSI)* 92(PB6/I2C1_SCL/TIM4_CH1/USART1_TX)* 93(PB7/I2C1_SDA/TIM4_CH2/USART1_RX)*; U11 5(Vref)*; U13 5(Vref)*

### Notes on the sheet
- 复位
- 电池电压检测
- 外部传感器电源控制
- 串口调试
- JTAG
- (in symbol 2.54-TX) TX
- (in symbol RV) U

### Library data of the parts
C1 C4-C32 C34-C37 C40-C44 C46-C52 = CAP
C2 C3 C38 C39 C53-C56 = CAP: 陶瓷电容
C33 = C
C45 = CAP: 钽电容
D1 D23 = DIODE
D2-D5 D7-D22 LED01 = LED-RED: 红色LED
D6 ZD1-ZD16 = Zener Diode
D24 LED1-LED8 = LED-RED: 绿色LED
DB1 = BRIDGE1
F1-F4 = FUSE2: SMD0805P010TS
F5 = FUSE2: RL60-110
J1 J01 = SIP2A-2.50（带槽）
J2-J17 = SIP4A-2.50(带槽)
J18-J27 J29 = SIP3A-2.50（带槽）
L1-L5 = INDUCTOR
P1 P2 = COAX-M: SMA-J-P-H-ST-TH1; PackageDocument: Rev. A, 16-Jun-1997; PCB_Layout: Complies with manufacturer's recommendation.; DrillSize: Corresponds to nominal value.; Published: 15-Jul-2004; LatestRevisionDate: 15-Jul-2004; LatestRevisionNote: Component Replaced.; DatasheetDocument: 30-May-2003; PackageReference: 908-21103; Publisher: Altium Limited; ComponentLink1Description: Manufacturer Link; ComponentLink1URL: http://www.amphenolrf.com/
Q1 Q01-Q35 = NPN1
R1 R91-R98 R110-R115 R117-R119 R121-R123 R126-R132 = RES-1%: 高精度电阻
R01 R99-R109 = Res
R2 R02-R90 R116 R120 R124 R125 = RES1
RN1 RN2 = RESPACK
RV1 = RV
TVS1-TVS4 = TVS: SMBJ12CA
U1 = STM32F103VET6: STM32 ARM-based 32-bit MCU with 64 Kbytes Flash, 100-pin LQFP, Industrial Temperature; Published: 30-May-2008; DatasheetVersion: rev6, Mar-2008; PackageVersion: Mar-2008; PackageReference: LQFP100; Publisher: Altium Limited; PackageDescription: 100-Pin Low-Profile Quad Flat Pack, 14 x 14 mm Body, 0.5 mm Pitch (LQFP100); ComponentLink1Description: Manufacturer Link; ComponentLink1URL: www.st.com/stm32; ComponentLink2Description: Datasheet; ComponentLink2URL: http://www.st.com/stonline/products/literature/ds/13587.pdf
U2 U6-U9 = TLP521: 光耦
U3 U4 = MAX3485
U14 U15 = TVS_CAN: NUP2105L
Y1 = XTAL: Crystal Oscillator; Published: 8-Jun-2000; LatestRevisionDate: 17-Jul-2002; LatestRevisionNote: Re-released for DXP Platform.; Publisher: Altium Limited